# Altium schematic sheet RFTransceiver.SchDoc
size A4
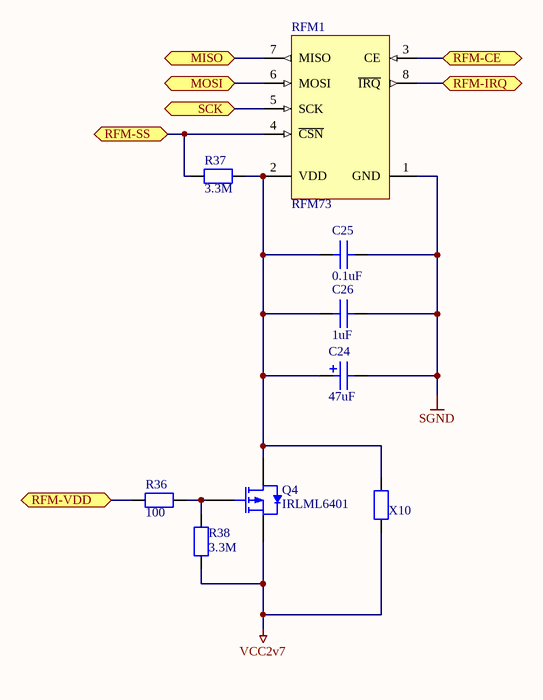
[diagram p0: RFTransceiver.SchDoc]

## Parts
C24  value 47uF  [TC2917]  (hidden comment: C47uF-10V-tant)
C25  value 0.1uF  [C0805]  (hidden comment: C0.1uF-50V)
C26  value 1uF  [C0805]  (hidden comment: C1uF-50V)
Q4  IRLML6401  [SOT23_N]
R36  value 100  [R0805]  (hidden comment: R100-5%)
R37  value 3.3M  [R0805]  (hidden comment: R3.3M-5%)
R38  value 3.3M  [R0805]  (hidden comment: R3.3M-5%)
RFM1  RFM73  [RFM73-SML]
X10  JUMPER0  [R0805]  (value not drawn)

## Ports
MISO, MOSI, RFM-CE, RFM-IRQ, RFM-SS, RFM-VDD, SCK

## Nets
SGND: C24.2 C25.2 C26.2 RFM1.1(GND)
VCC2v7: Q4.2(S) R38.2 X10.1
MISO: RFM1.7(MISO) ; port MISO
MOSI: RFM1.6(MOSI) ; port MOSI
RFM-CE: RFM1.3(CE) ; port RFM-CE
RFM-IRQ: RFM1.8(~{IRQ}) ; port RFM-IRQ
RFM-SS: R37.2 RFM1.4(~{CSN}) ; port RFM-SS
RFM-VDD: R36.1 ; port RFM-VDD
SCK: RFM1.5(SCK) ; port SCK
NetC24_1: C24.1 C25.1 C26.1 Q4.3(D) R37.1 RFM1.2(VDD) X10.2
NetQ4_1: Q4.1(G) R36.2 R38.1

## Library data of the parts
C24 = C47uF-10V-tant: Type: Конденсатор танталовый; Voltage: 10V; Name: C47uF-10V-tant
C25 = C0.1uF-50V: Type: Конденсатор керамический; Voltage: 50V; Name: C0.1uF-50V
C26 = C1uF-50V: Type: Конденсатор керамический; Voltage: 50V; Name: C1uF-50V
Q4 = IRLML6401: P-Channel Power MOSFET; Type: MOSFET P-канал; Vds: 12V; Id: 4.3A; Vgs: 0.4-0.95V; Name: IRLML6401
R36 = R100-5%: R-100-5%; Precision: 5%; Type: Резистор; Name: R100-5%
R37 R38 = R3.3M-5%: Precision: 5%; Type: Резистор; Name: R3.3M-5%
RFM1 = RFM73: 2.4GHz GFSK Transceiver; Name: RFM73; Type: Радиомодуль 2.4 ГГц
X10 = JUMPER0: Type: Перемычка; Name: JUMPER0